# EAGLE schematic ETHERUNO (EAGLE 9.6.2)

## Sheet 1 of 4
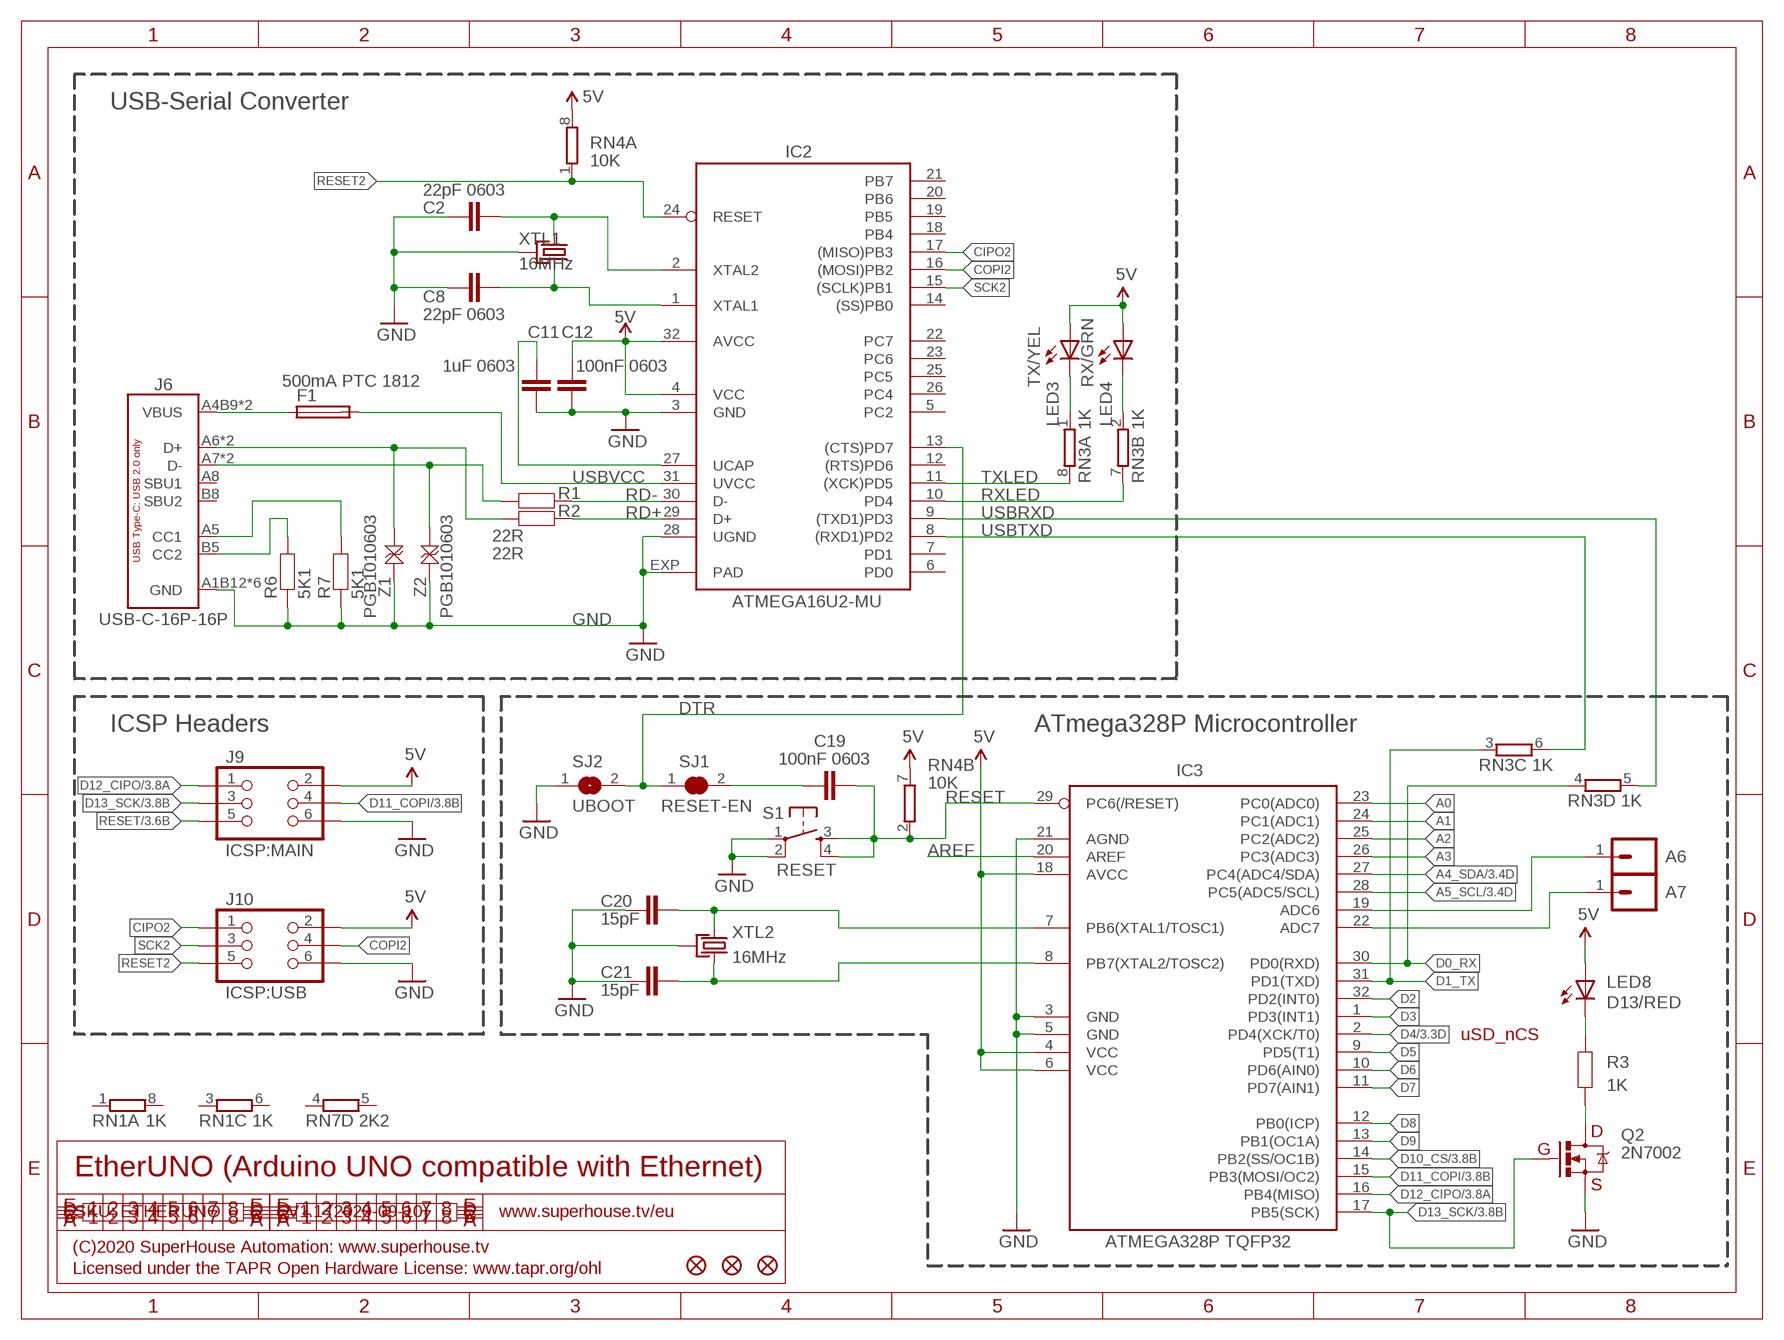
[diagram p0: schematic, sheet 1]

### Parts
A6  A6  M01-PLAIN  [1X01]
A7  A7  M01-PLAIN  [1X01]
C2  22pF 0603  CAP0603  [C0603]
C8  22pF 0603  CAP0603  [C0603]
C11  1uF 0603  CAP0603  [C0603]
C12  100nF 0603  CAP0603  [C0603]
C19  100nF 0603  CAP0603  [C0603]
C20  15pF  CAP0603  [C0603]
C21  15pF  CAP0603  [C0603]
F1  500mA PTC 1812  PTC050  [1812]
FID1  FIDUCIAL1X2.5  [FIDUCIAL-1X2.5]
FID2  FIDUCIAL1X2.5  [FIDUCIAL-1X2.5]
FID3  FIDUCIAL1X2.5  [FIDUCIAL-1X2.5]
IC2  ATMEGA16U2-MU  ATMEGA8U2QFN  [ATMEL_QFN32]
IC3  ATMEGA328P TQFP32  AVR-MEGA8-AI  [TQFP32-08]
J6  USB-C-16P-16P  [USB-C-16P]
J9  ICSP:MAIN  ICSP-PIN  [2X03-ICSP]
J10  ICSP:USB  ICSP-PIN  [2X03-ICSP]
LED3  TX/YEL  LED0603  [LED-0603]
LED4  RX/GRN  LED0603  [LED-0603]
LED8  D13/RED  LED0603  [LED-0603]
Q2  2N7002  MOSFET-NCHANNEL-233  [SOT23-3]
R1  22R  RESISTOR0603  [R0603]
R2  22R  RESISTOR0603  [R0603]
R3  1K  RESISTOR0603  [R0603]
R6  5K1  RESISTOR0603  [R0603]
R7  5K1  RESISTOR0603  [R0603]
RN1  1K  4R-NCAY16  [CAY16]
RN3  1K  4R-NCAY16  [CAY16]
RN4  10K  4R-NCAY16  [CAY16]
RN7  2K2  4R-NCAY16  [CAY16]
S1  RESET  TAC_SWITCH-SMT-6  [TACTILE_SMT-6MM]
SJ1  RESET-EN  SJC-NORMAL  [SJC]
SJ2  UBOOT  SJ-NORMAL  [SJ]
XTL1  16MHz  CRYSTAL-GND3X2  [CRYSTAL-SMD-3X2]
XTL2  16MHz  CRYSTAL-GND3X2  [CRYSTAL-SMD-3X2]
Z1  PGB1010603  TVS0603  [TVS0603]
Z2  PGB1010603  TVS0603  [TVS0603]

### Nets
5V [power]: C12.1 IC2.4(VCC) IC2.32(AVCC) IC3.4(VCC) IC3.6(VCC) IC3.18(AVCC) J9.2 J10.2 LED3.A LED4.A LED8.A RN4.7 RN4.8 ; also sheet 2,3,4
A0: IC3.23(PC0(ADC0)) ; also sheet 4
A1: IC3.24(PC1(ADC1)) ; also sheet 4
A2: IC3.25(PC2(ADC2)) ; also sheet 4
A3: IC3.26(PC3(ADC3)) ; also sheet 4
A4_SDA: IC3.27(PC4(ADC4/SDA)) ; also sheet 3,4
A5_SCL: IC3.28(PC5(ADC5/SCL)) ; also sheet 3,4
AREF: IC3.20(AREF) ; also sheet 4
CIPO2: IC2.17((MISO)PB3) J10.1
COPI2: IC2.16((MOSI)PB2) J10.4
D0_RX: IC3.30(PD0(RXD)) RN3.4 ; also sheet 4
D1_TX: IC3.31(PD1(TXD)) RN3.3 ; also sheet 4
D2: IC3.32(PD2(INT0)) ; also sheet 4
D3: IC3.1(PD3(INT1)) ; also sheet 4
D4: IC3.2(PD4(XCK/T0)) ; also sheet 3,4
D5: IC3.9(PD5(T1)) ; also sheet 4
D6: IC3.10(PD6(AIN0)) ; also sheet 4
D7: IC3.11(PD7(AIN1)) ; also sheet 4
D8: IC3.12(PB0(ICP)) ; also sheet 4
D9: IC3.13(PB1(OC1A)) ; also sheet 4
D10_CS: IC3.14(PB2(SS/OC1B)) ; also sheet 3,4
D11_COPI: IC3.15(PB3(MOSI/OC2)) J9.4 ; also sheet 3,4
D12_CIPO: IC3.16(PB4(MISO)) J9.1 ; also sheet 3,4
D13_SCK: IC3.17(PB5(SCK)) J9.3 Q2.1(G) ; also sheet 3,4
DTR: IC2.13((CTS)PD7) SJ1.1 SJ2.2
GND: C2.1 C8.1 C11.2 C12.2 C20.1 C21.1 IC2.3(GND) IC2.28(UGND) IC2.EXP(PAD) IC3.3(GND) IC3.5(GND) IC3.21(AGND) J6.A1B12(GND) J6.A12B1(GND) J6.FIX1(GND) J6.FIX2(GND) J6.FIX3(GND) J6.FIX4(GND) J9.6 J10.6 Q2.2(S) R6.1 R7.1 S1.1 S1.2 SJ2.1 XTL1.2(GND) XTL1.4(GND) XTL2.2(GND) XTL2.4(GND) Z1.2 Z2.2 ; also sheet 2,3,4
N$2: C20.2 IC3.7(PB6(XTAL1/TOSC1)) XTL2.1
N$3: C19.1 SJ1.2
N$4: LED8.C R3.2
N$6: Q2.3(D) R3.1
N$7: C21.2 IC3.8(PB7(XTAL2/TOSC2)) XTL2.3
N$8: C8.2 IC2.1(XTAL1) XTL1.3
N$9: J6.B5(CC2) R6.2
N$11: LED4.C RN3.2
N$13: LED3.C RN3.1
N$16: J6.A6(D+) J6.B6(D+) R2.2 Z1.1
N$17: J6.A7(D-) J6.B7(D-) R1.2 Z2.1
N$21: A7.1 IC3.22(ADC7)
N$22: A6.1 IC3.19(ADC6)
N$30: J6.A5(CC1) R7.2
N$113: C2.2 IC2.2(XTAL2) XTL1.1
N$115: F1.1 J6.A4B9(VBUS) J6.A9B4(VBUS)
N$117: C11.1 IC2.27(UCAP)
RD+: IC2.29(D+) R2.1
RD-: IC2.30(D-) R1.1
RESET: C19.2 IC3.29(PC6(/RESET)) J9.5 RN4.2 S1.3 S1.4 ; also sheet 3,4
RESET2: IC2.24(RESET) J10.5 RN4.1
RXLED: IC2.10(PD4) RN3.7
SCK2: IC2.15((SCLK)PB1) J10.3
TXLED: IC2.11((XCK)PD5) RN3.8
USBRXD: IC2.9((TXD1)PD3) RN3.5
USBTXD: IC2.8((RXD1)PD2) RN3.6
USBVCC: F1.2 IC2.31(UVCC) ; also sheet 2
Unconnected: IC2.5(PC2) IC2.6(PD0) IC2.7(PD1) IC2.12((RTS)PD6) IC2.14((SS)PB0) IC2.18(PB4) IC2.19(PB5) IC2.20(PB6) IC2.21(PB7) IC2.22(PC7) IC2.23(PC6) IC2.25(PC5) IC2.26(PC4) J6.A8(SBU1) J6.B8(SBU2) RN1.1 RN1.3 RN1.6 RN1.8 RN7.4 RN7.5

### Notes on the sheet
- USB-Serial Converter
- ICSP Headers | ATmega328P Microcontroller
- uSD_nCS
- D
- G
- EtherUNO (Arduino UNO compatible with Ethernet)
- S
- SKU: ETHERUNO | V1.1 (2020-09-10) | www.superhouse.tv/eu
- (C)2020 SuperHouse Automation: www.superhouse.tv
- Licensed under the TAPR Open Hardware License: www.tapr.org/ohl

## Sheet 2 of 4
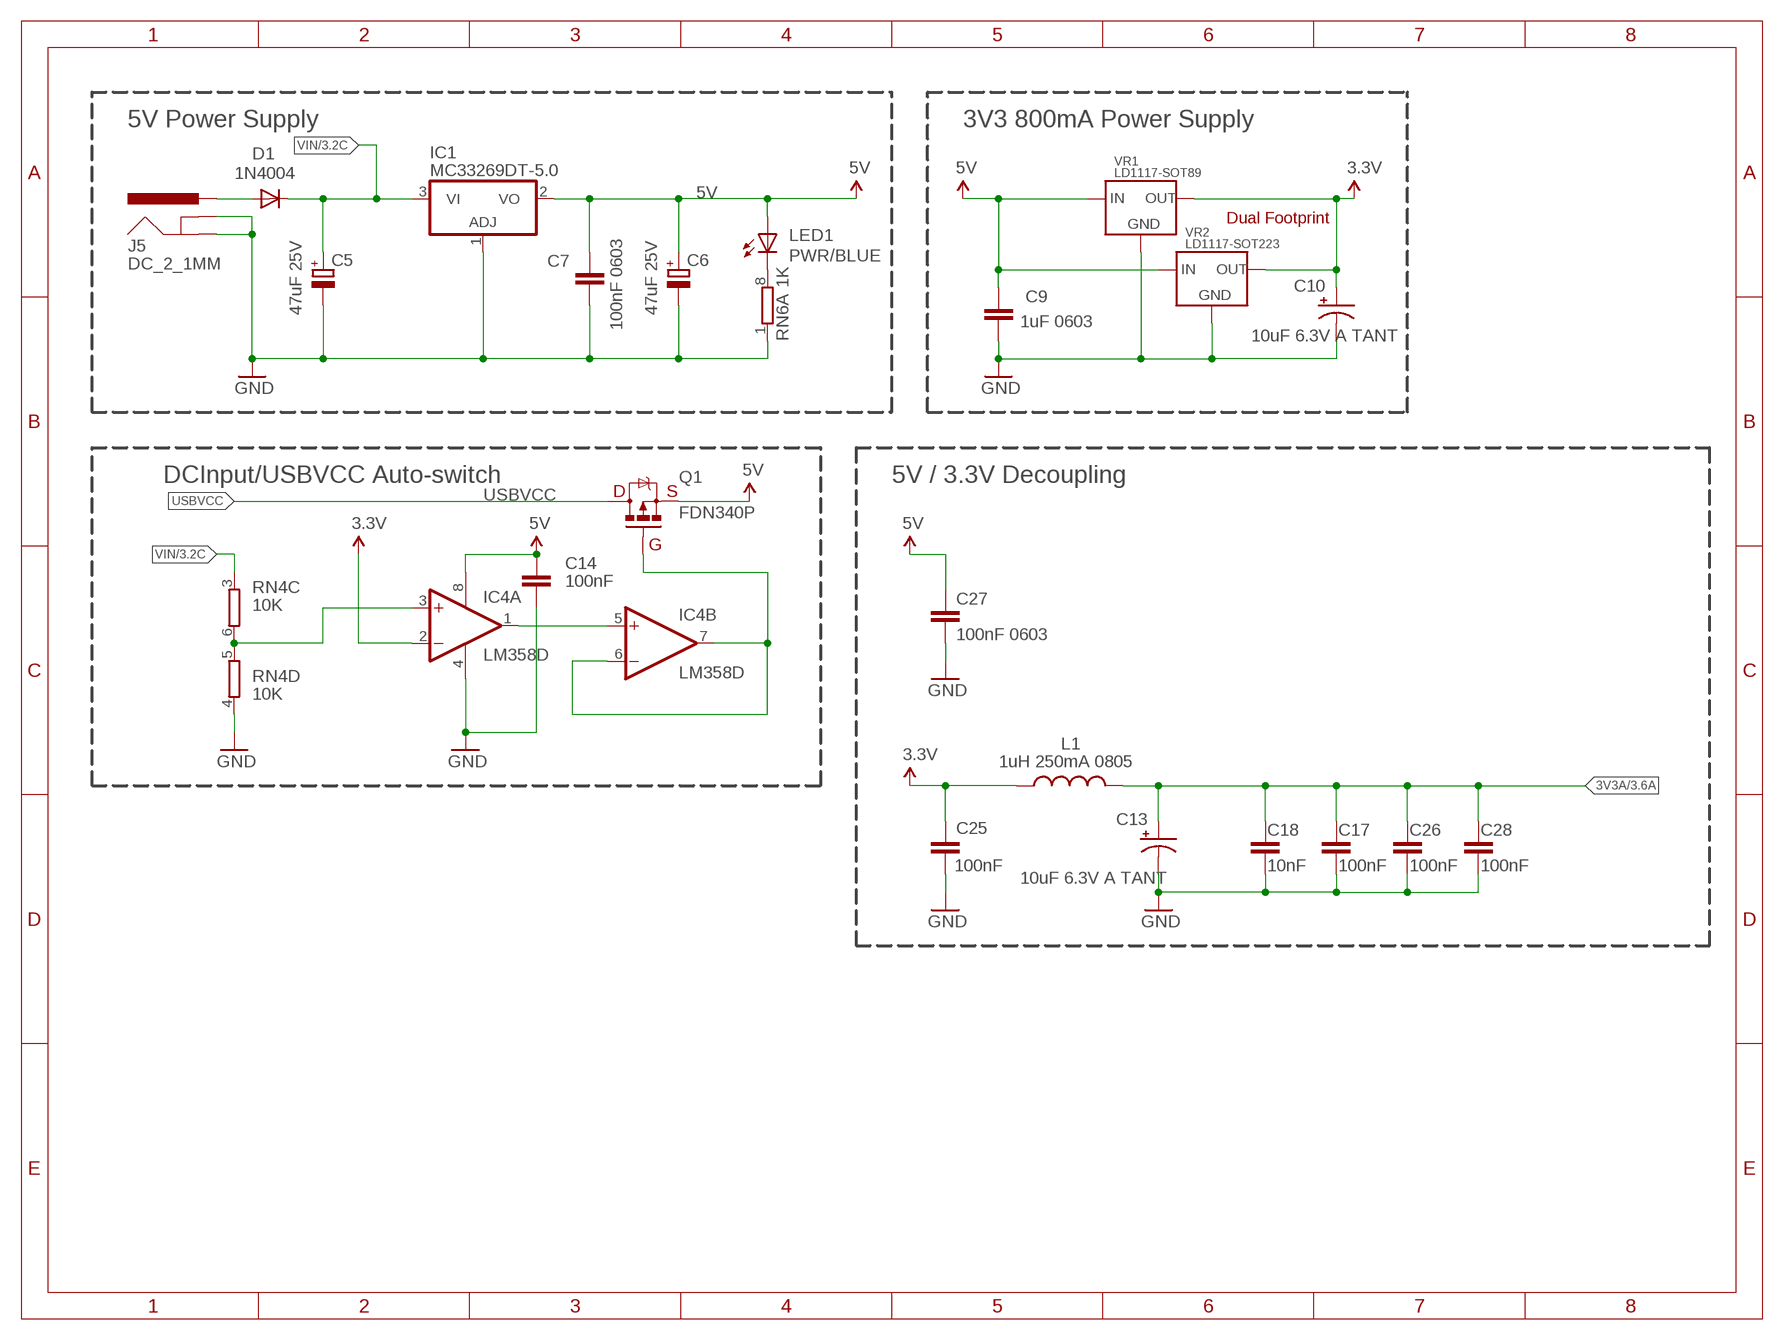
[diagram p1: schematic, sheet 2]

### Parts
C5  47uF 25V  CPOL-EUD  [PANASONIC_D]
C6  47uF 25V  CPOL-EUD  [PANASONIC_D]
C7  100nF 0603  CAP0603  [C0603]
C9  1uF 0603  CAP0603  [C0603]
C10  10uF 6.3V A TANT  CAP_POL1206  [EIA3216]
C13  10uF 6.3V A TANT  CAP_POL1206  [EIA3216]
C14  100nF  CAP0603  [C0603]
C17  100nF  CAP0603  [C0603]
C18  10nF  CAP0603  [C0603]
C25  100nF  CAP0603  [C0603]
C26  100nF  CAP0603  [C0603]
C27  100nF 0603  CAP0603  [C0603]
C28  100nF  CAP0603  [C0603]
D1  1N4004  DIODESMA  [SMA-DIODE]
IC1  MC33269DT-5.0  MC33269-X-5.0-D  [DPACK]
IC4  LM358D  [SO08]
J5  DC_2_1MM  POWER_JACK-SLOTS  [POWER_JACK_SLOTS]
L1  1uH 250mA 0805  L-USL2012C  [L2012C]
LED1  PWR/BLUE  LED0603  [LED-0603]
Q1  FDN340P  MOSFET-PCHANNEL  [SOT23]
RN6  1K  4R-NCAY16  [CAY16]
VR1  LD1117-SOT89  [SOT89]
VR2  LD1117-SOT223  [SOT-223]

### Nets
3.3V: C10.A(+) C25.1 IC4.2(A:-IN) L1.1 VR1.2(OUT) VR1.4(OUT) VR2.2(OUT) VR2.4(OUT) ; also sheet 3,4
3V3A: C13.A(+) C17.1 C18.1 C26.1 C28.1 L1.2 ; also sheet 3
5V [power]: C6.+ C7.1 C9.1 C14.1 C27.1 IC1.2(VO) IC4.8(P:V+) LED1.A Q1.2(S) VR1.3(IN) VR2.3(IN) ; also sheet 1,3,4
GND: C5.- C6.- C7.2 C9.2 C10.C(-) C13.C(-) C14.2 C17.2 C18.2 C25.2 C26.2 C27.2 C28.2 IC1.1(ADJ) IC4.4(P:V-) J5.GND J5.GNDBREAK RN4.4 RN6.1 VR1.1(GND) VR2.1(GND) ; also sheet 1,3,4
N$12: IC4.3(A:+IN) RN4.5 RN4.6
N$14: LED1.C RN6.8
N$18: IC4.6(B:-IN) IC4.7(B:OUT) Q1.1(G)
N$19: IC4.1(A:OUT) IC4.5(B:+IN)
N$60: D1.A J5.PWR
USBVCC: Q1.3(D) ; also sheet 1
VIN: C5.+ D1.C IC1.3(VI) RN4.3 ; also sheet 3,4

### Notes on the sheet
- 5V Power Supply | 3V3 800mA Power Supply
- Dual Footprint
- DCInput/USBVCC Auto-switch | 5V / 3.3V Decoupling
- D | S
- G

## Sheet 3 of 4
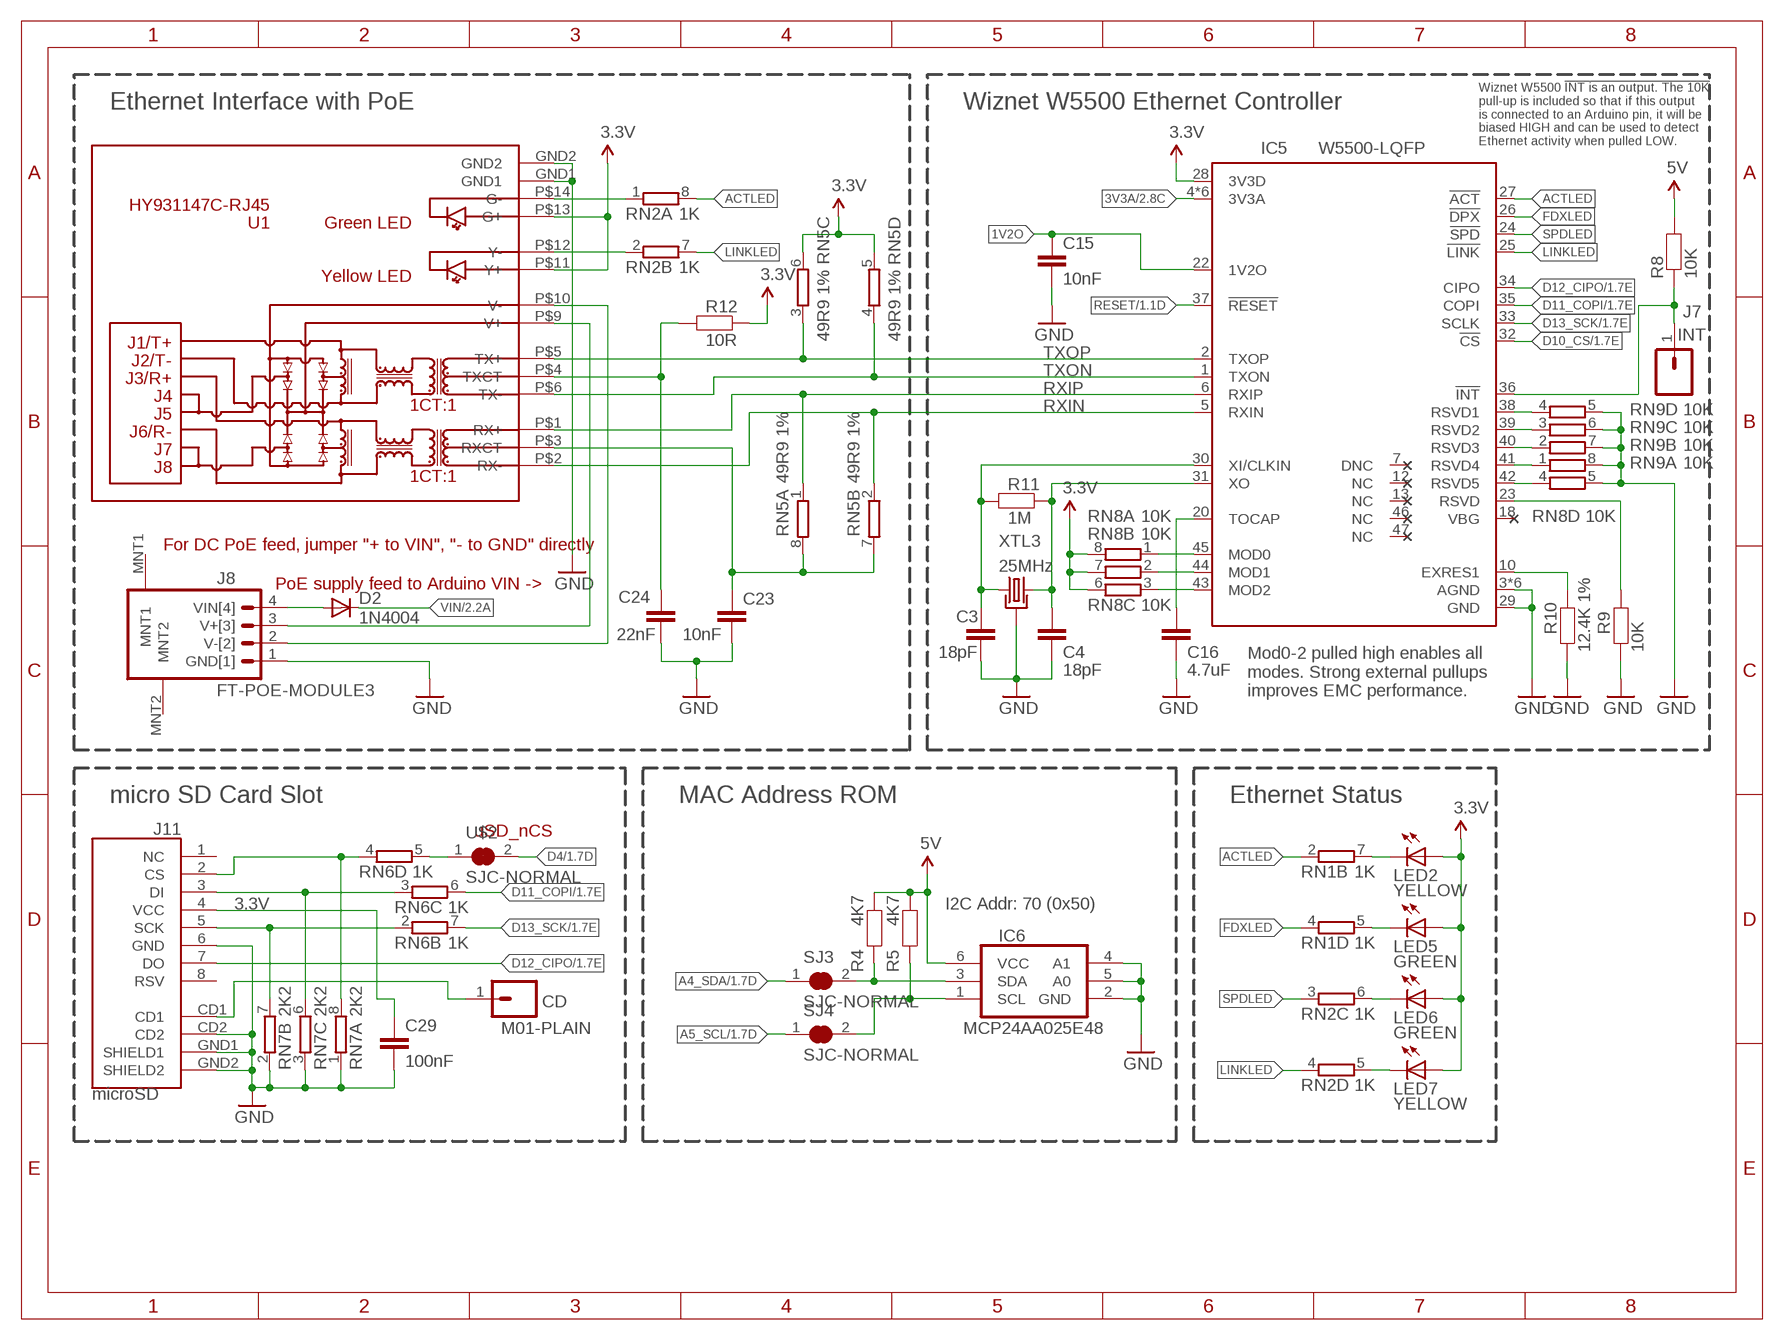
[diagram p2: schematic, sheet 3]

### Parts
C3  18pF  CAP0603  [C0603]
C4  18pF  CAP0603  [C0603]
C15  10nF  CAP0603  [C0603]
C16  4.7uF  CAP0603  [C0603]
C23  10nF  CAP0603  [C0603]
C24  22nF  CAP0603  [C0603]
C29  100nF  CAP0603  [C0603]
CD  M01-PLAIN  [1X01]
D2  1N4004  DIODESMA  [SMA-DIODE]
IC5  W5500-LQFP  [LQFP48]
IC6  MCP24AA025E48  [SOT23-6]
J7  INT  M01-PLAIN  [1X01]
J8  FT-POE-MODULE3  [FT-POE-MODULE-NOLABEL]
J11  microSD  USD-SOCKETNEW  [MICRO-SD-SOCKET-PP]
LED2  YELLOW  LED0603  [LED-0603]
LED5  GREEN  LED0603  [LED-0603]
LED6  GREEN  LED0603  [LED-0603]
LED7  YELLOW  LED0603  [LED-0603]
R4  4K7  RESISTOR0603  [R0603]
R5  4K7  RESISTOR0603  [R0603]
R8  10K  RESISTOR0603  [R0603]
R9  10K  RESISTOR0603  [R0603]
R10  12.4K 1%  RESISTOR0603  [R0603]
R11  1M  RESISTOR0603  [R0603]
R12  10R  RESISTOR0603  [R0603]
RN2  1K  4R-NCAY16  [CAY16]
RN5  49R9 1%  4R-NCAY16  [CAY16]
RN8  10K  4R-NCAY16  [CAY16]
RN9  10K  4R-NCAY16  [CAY16]
SJ3  SJC-NORMAL  [SJC]
SJ4  SJC-NORMAL  [SJC]
U1  HY931147C-RJ45  [HY931147C]
U$2  SJC-NORMAL  [SJC]
XTL3  25MHz  CRYSTAL-GND3X2  [CRYSTAL-SMD-3X2]

### Nets
1V2O: C15.1 IC5.22(1V2O)
3.3V: C29.1 IC5.28(3V3D) J11.4(VCC) LED2.A LED5.A LED6.A LED7.A R12.1 RN5.5 RN5.6 RN8.6 RN8.7 RN8.8 U1.P$11(Y+) U1.P$13(G+) ; also sheet 2,4
3V3A: IC5.4(3V3A) IC5.8(3V3A) IC5.11(3V3A) IC5.15(3V3A) IC5.17(3V3A) IC5.21(3V3A) ; also sheet 2
5V [power]: IC6.6(VCC) R4.1 R5.1 R8.2 ; also sheet 1,2,4
A4_SDA: SJ3.1 ; also sheet 1,4
A5_SCL: SJ4.1 ; also sheet 1,4
ACTLED: IC5.27(!ACT) RN1.2 RN2.8
D4: U$2.2 ; also sheet 1,4
D10_CS: IC5.32(!CS) ; also sheet 1,4
D11_COPI: IC5.35(COPI) RN6.6 ; also sheet 1,4
D12_CIPO: IC5.34(CIPO) J11.7(DO) ; also sheet 1,4
D13_SCK: IC5.33(SCLK) RN6.7 ; also sheet 1,4
FDXLED: IC5.26(!DPX) RN1.4
GND: C3.2 C4.2 C15.2 C16.2 C23.2 C24.2 C29.2 IC5.3(AGND) IC5.9(AGND) IC5.14(AGND) IC5.16(AGND) IC5.19(AGND) IC5.29(GND) IC5.48(AGND) IC6.2(GND) IC6.4(A1) IC6.5(A0) J8.1(GND[1]) J11.6(GND) J11.CD2 J11.GND1(SHIELD1) J11.GND2(SHIELD2) R9.2 R10.2 RN7.1 RN7.2 RN7.3 RN8.5 RN9.5 RN9.6 RN9.7 RN9.8 U1.GND1 U1.GND2 XTL3.2(GND) XTL3.4(GND) ; also sheet 1,2,4
LINKLED: IC5.25(!LINK) RN2.4 RN2.7
N$1: C23.1 RN5.7 RN5.8 U1.P$3(RXCT)
N$5: IC6.1(SCL) R5.2 SJ4.2
N$10: C4.1 IC5.31(XO) R11.1 XTL3.3
N$15: D2.A J8.4(VIN[4])
N$20: J11.2(CS) RN6.4 RN7.8
N$23: CD.1 J11.CD1
N$24: J11.5(SCK) RN6.2 RN7.7
N$25: J11.3(DI) RN6.3 RN7.6
N$26: LED6.C RN2.6
N$27: C3.1 IC5.30(XI/CLKIN) R11.2 XTL3.1
N$28: LED7.C RN2.5
N$29: IC6.3(SDA) R4.2 SJ3.2
N$31: C16.1 IC5.20(TOCAP)
N$32: C24.1 R12.2 U1.P$4(TXCT)
N$33: IC5.10(EXRES1) R10.1
N$34: IC5.23(RSVD) R9.1
N$35: IC5.36(!INT) J7.1 R8.1
N$36: IC5.45(MOD0) RN8.1
N$37: IC5.44(MOD1) RN8.2
N$38: IC5.43(MOD2) RN8.3
N$39: IC5.42(RSVD5) RN8.4
N$40: IC5.41(RSVD4) RN9.1
N$41: IC5.40(RSVD3) RN9.2
N$42: IC5.39(RSVD2) RN9.3
N$43: IC5.38(RSVD1) RN9.4
N$44: RN6.5 U$2.1
N$67: RN2.1 U1.P$14(G-)
N$68: J8.3(V+[3]) U1.P$9(V+)
N$69: J8.2(V-[2]) U1.P$10(V-)
N$327: LED5.C RN1.5
N$329: LED2.C RN1.7
N$332: RN2.2 U1.P$12(Y-)
RESET: IC5.37(!RESET) ; also sheet 1,4
RXIN: IC5.5(RXIN) RN5.2 U1.P$2(RX-)
RXIP: IC5.6(RXIP) RN5.1 U1.P$1(RX+)
SPDLED: IC5.24(!SPD) RN2.3
TXON: IC5.1(TXON) RN5.4 U1.P$6(TX-)
TXOP: IC5.2(TXOP) RN5.3 U1.P$5(TX+)
VIN: D2.C ; also sheet 2,4
Unconnected: IC5.7(DNC) IC5.12(NC) IC5.13(NC) IC5.18(VBG) IC5.46(NC) IC5.47(NC) J8.MNT1 J8.MNT2 J11.1(NC) J11.8(RSV)

### Notes on the sheet
- Ethernet Interface with PoE | Wiznet W5500 Ethernet Controller
- Wiznet W5500 !INT is an output. The 10K
  pull-up is included so that if this output
  is connected to an Arduino pin, it will be
  biased HIGH and can be used to detect
  Ethernet activity when pulled LOW.
- For DC PoE feed, jumper "+ to VIN", "- to GND" directly
- PoE supply feed to Arduino VIN ->
- Mod0-2 pulled high enables all
  modes. Strong external pullups
  improves EMC performance.
- micro SD Card Slot | MAC Address ROM | Ethernet Status
- uSD_nCS
- I2C Addr: 70 (0x50)

## Sheet 4 of 4
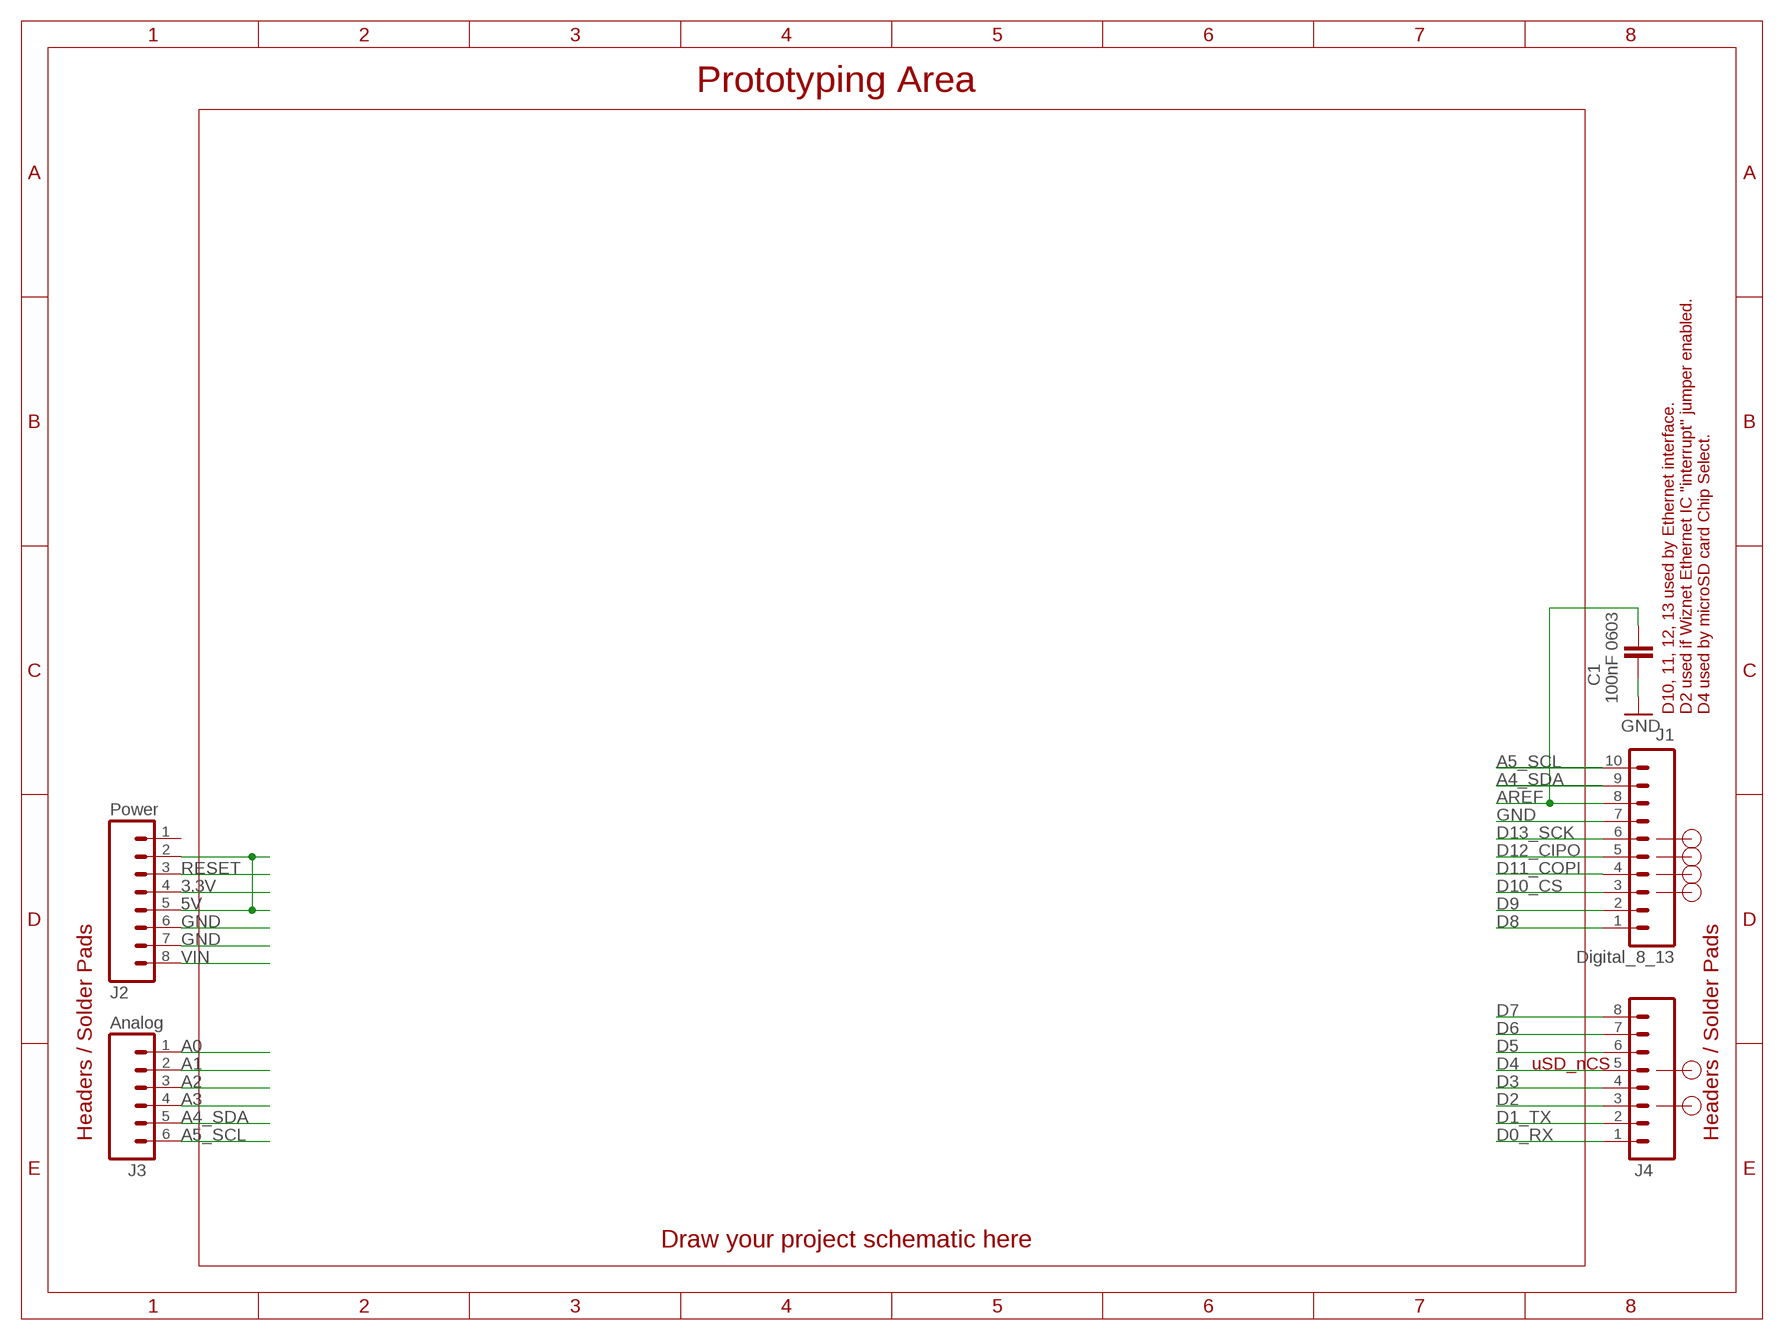
[diagram p3: schematic, sheet 4]

### Parts
C1  100nF 0603  CAP0603  [C0603]
J1  Digital_8_13  M10-SOCKET  [1X10-S]
J2  Power  M08-SOCKET  [1X08-S]
J3  Analog  M06-SOCKET  [1X06-S]
J4  Digital_0_7  M08-SOCKET  [1X08-S]

### Nets
3.3V: J2.4 ; also sheet 2,3
5V [power]: J2.2 J2.5 ; also sheet 1,2,3
A0: J3.1 ; also sheet 1
A1: J3.2 ; also sheet 1
A2: J3.3 ; also sheet 1
A3: J3.4 ; also sheet 1
A4_SDA: J1.9 J3.5 ; also sheet 1,3
A5_SCL: J1.10 J3.6 ; also sheet 1,3
AREF: C1.1 J1.8 ; also sheet 1
D0_RX: J4.1 ; also sheet 1
D1_TX: J4.2 ; also sheet 1
D2: J4.3 ; also sheet 1
D3: J4.4 ; also sheet 1
D4: J4.5 ; also sheet 1,3
D5: J4.6 ; also sheet 1
D6: J4.7 ; also sheet 1
D7: J4.8 ; also sheet 1
D8: J1.1 ; also sheet 1
D9: J1.2 ; also sheet 1
D10_CS: J1.3 ; also sheet 1,3
D11_COPI: J1.4 ; also sheet 1,3
D12_CIPO: J1.5 ; also sheet 1,3
D13_SCK: J1.6 ; also sheet 1,3
GND: C1.2 J1.7 J2.6 J2.7 ; also sheet 1,2,3
RESET: J2.3 ; also sheet 1,3
VIN: J2.8 ; also sheet 2,3
Unconnected: J2.1

### Notes on the sheet
- Prototyping Area
- D10, 11, 12, 13 used by Ethernet interface. | D2 used if Wiznet Ethernet IC "interrupt" jumper enabled. | D4 used by microSD card Chip Select.
- uSD_nCS
- Headers / Solder Pads | Headers / Solder Pads
- Draw your project schematic here

## Library data of the parts
A6 A7 CD J7 = SuperHouse-Connectors:M01: 1-way header Standard 1x1 header
C1-C4 C7-C9 C11 C12 C14-C21 C23-C29 = SuperHouse-DiscreteSemi:CAP: Capacitor Standard ceramic capacitor
C5 C6 = rcl:CPOL-EU: POLARIZED CAPACITOR, European symbol; SPICEPREFIX: C
C10 C13 = SuperHouse-DiscreteSemi:CAP_POL: Capacitor Polarized These are standard SMD and PTH capacitors. Normally 10uF, 47uF, and 100uF in electrolytic and tantalum varieties. Always verify the external diameter of the through hole cap, it varies with capacity, voltage, and manufacturer. The EIA devices should be standard.
D1 D2 = SuperHouse-DiscreteSemi:DIODE: Diode Standard reverse protection diodes and small signal diodes. SMA package can handle up to about 1A. SOD-323 can handle about 200mA.
F1 = SuperHouse-Fuses:PTC: MF-SMDF Series - PRC Resettable Fuses Source: http://www.farnell.com/datasheets/716597.pdf
FID1-FID3 = SuperHouse-Symbols:FIDUCIAL: Fiducial Alignment Points Various fiducial points for machine vision alignment.
IC1 = SuperHouse-Regulators:MC33269-X: Adjustable Output Low Dropout Voltage Regulator 800 mA Source: http://www.onsemi.com/pub/Collateral/MC33269-D.PDF
IC2 = SuperHouse-MCUs:ATMEGA8U2: ATmega8U2 / 16U2 MCU
IC3 = SuperHouse-MCUs:AVR-MEGA8: MICROCONTROLLER 8 Kbytes FLASH 1 kbytes SRAM 512 bytes EEPROM USART 6-channel 10 bit ADC 2-channel 8 bit ADC
IC4 = SuperHouse-ICs:LM358: OP AMP also LM158; LM258; LM2904 Source: http://cache.national.com/ds/LM/LM158.pdf
IC5 = SuperHouse-ICs:W5500
IC6 = freetronics-jon:MCP24AA025E48
J1 = SuperHouse-Connectors:M10: 10-way header Standard 1x10 header, and screw terminal variations
J2 J4 = SuperHouse-Connectors:M08: 8-way header Standard 1x8 header, and screw terminal variations
J3 = SuperHouse-Connectors:M06: 6-way header Standard 1x6 header, and screw terminal variations
J5 = SuperHouse-Connectors:POWER_JACK: Power Jack This is the standard 5.5mm barrel jack for power. The PTH is the most common, proven, reliable, footprint. All others are experimental. The Slot footprint only works if the mill layer is transmitted to the PCB fab house so be warned. Spark Fun Electronics SKU : PRT-00119. Mating wall wart : TOL-00298 (and others)
J6 = SuperHouse-Connectors:USB-C-16P: USB-C socket with 16 pins, suitable only for backward compatibility with USB 2
J8 = freetronics-master-v1.1:FT-POE-MODULE
J9 J10 = SuperHouse-Connectors:ICSP
J11 = SuperHouse-Connectors:USD-SOCKET: microSD Socket Push-push type uSD socket. Schematic element and footprint production proven. Spark Fun Electronics SKU : PRT-00127. tDoc lines correctly indicate media card edge positions when inserting (unlocked, locked, depressed).
L1 = rcl:L-US: INDUCTOR, American symbol; SPICEPREFIX: L
LED1-LED8 = SuperHouse-LEDs:LED: LEDs Standard schematic elements and footprints for 5mm, 3mm, 1206, and 0603 sized LEDs. 5mm - Spark Fun Electronics SKU : COM-00529 (and others)
Q1 = freetronics-master-v1:MOSFET-PCHANNEL
Q2 = SuperHouse-DiscreteSemi:MOSFET-NCHANNEL: N-channel MOSFET
R1-R12 = SuperHouse-DiscreteSemi:RESISTOR: Resistor Standard resistors.
RN1-RN9 = SuperHouse-DiscreteSemi:4R-N: Array Chip Resistor Source: RS Component / Phycomp
S1 = SuperHouse-Switches:TAC_SWITCH: Momentary Switch Tactile switch, normally-open.
SJ1 SJ3 SJ4 U$2 = SuperHouse-Jumpers:SJC: Solder jumper. Normally closed: does not need solder to close. Can be opened by cutting the track.
SJ2 = SuperHouse-Jumpers:SJ: SMD solder jumper, normally-open. Add solder to close the connection.
U1 = SuperHouse-Connectors:HY931147C: Hanrun RJ45 socket HY931147C
VR1 VR2 = SuperHouse-Regulators:LD1117: Fixed-voltage LD1117 series LDOs. Note that the ground pin is labelled as ground, not as adj, because it's not the adjustable-voltage part.
XTL1-XTL3 = SuperHouse-Oscillators:CRYSTAL-GND: 3x2mm SMT crystal
Z1 Z2 = SuperHouse-DiscreteSemi:TVS: TVS voltage protection Zener